# EAGLE schematic Charging Dock 1.8 (EAGLE 7.7.0)
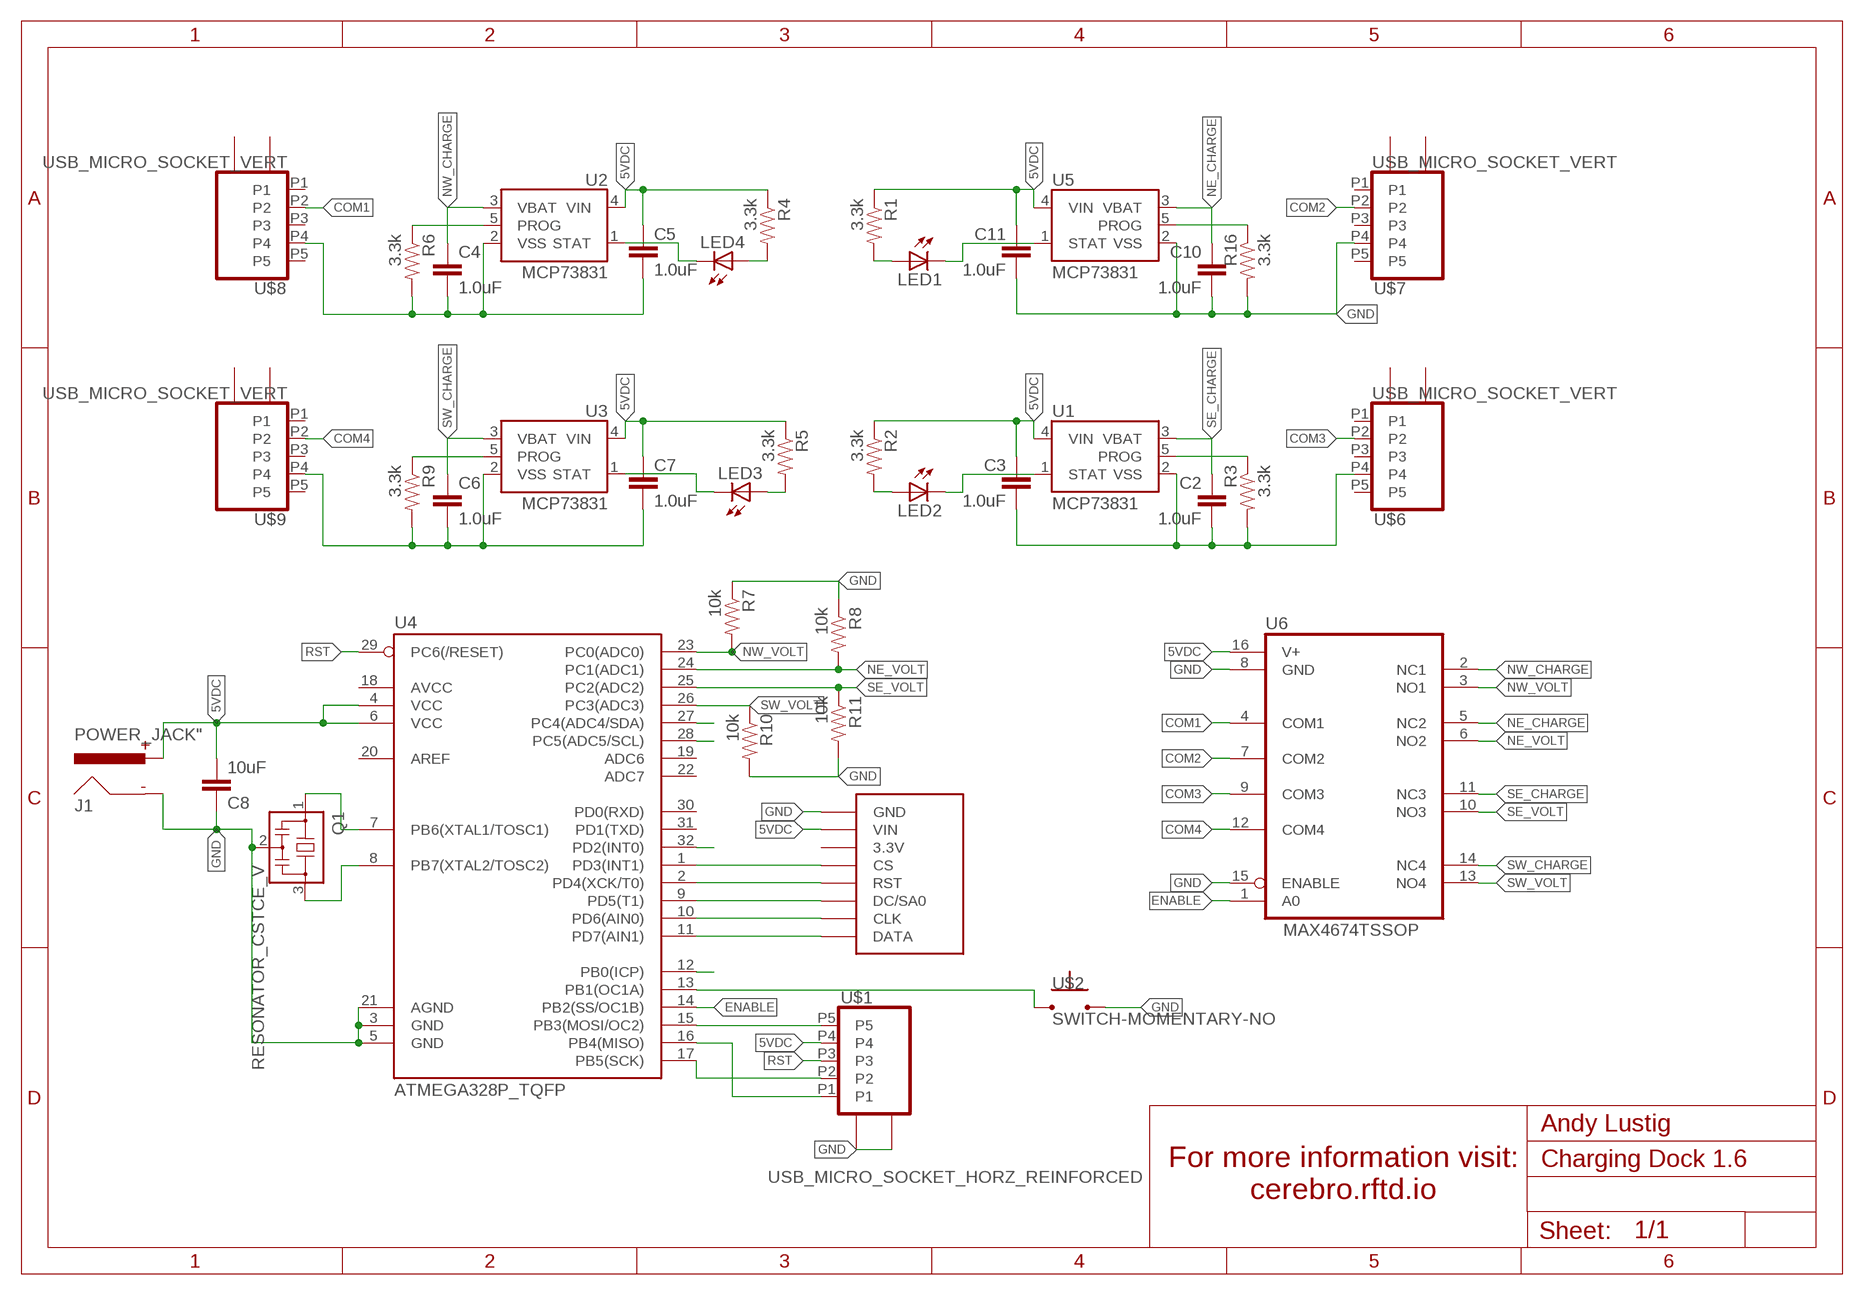
[diagram p0: schematic, sheet 1]

## Parts
C2  1.0uF  1.0UF-25V-+80/-20(0805)"  [0805-CAP]
C3  1.0uF  1.0UF-25V-+80/-20(0805)"  [0805-CAP]
C4  1.0uF  1.0UF-25V-+80/-20(0805)"  [0805-CAP]
C5  1.0uF  1.0UF-25V-+80/-20(0805)"  [0805-CAP]
C6  1.0uF  1.0UF-25V-+80/-20(0805)"  [0805-CAP]
C7  1.0uF  1.0UF-25V-+80/-20(0805)"  [0805-CAP]
C8  10uF  1.0UF-25V-+80/-20(0805)"  [0805-CAP]
C10  1.0uF  1.0UF-25V-+80/-20(0805)"  [0805-CAP]
C11  1.0uF  1.0UF-25V-+80/-20(0805)"  [0805-CAP]
J1  POWER_JACK"  [BARREL_CONN]
LED1  LEDCHIPLED_0805  [CHIPLED_0805]
LED2  LEDCHIPLED_0805  [CHIPLED_0805]
LED3  LEDCHIPLED_0805  [CHIPLED_0805]
LED4  LEDCHIPLED_0805  [CHIPLED_0805]
Q1  RESONATOR_CSTCE_V  [CSTCE_V]
R1  3.3k  RESISTOR0805-RES  [0805]
R2  3.3k  RESISTOR0805-RES  [0805]
R3  3.3k  RESISTOR0805-RES  [0805]
R4  3.3k  RESISTOR0805-RES  [0805]
R5  3.3k  RESISTOR0805-RES  [0805]
R6  3.3k  RESISTOR0805-RES  [0805]
R7  10k  RESISTOR0805-RES  [0805]
R8  10k  RESISTOR0805-RES  [0805]
R9  3.3k  RESISTOR0805-RES  [0805]
R10  10k  RESISTOR0805-RES  [0805]
R11  10k  RESISTOR0805-RES  [0805]
R16  3.3k  RESISTOR0805-RES  [0805]
U1  MCP73831  [SOT23-5]
U2  MCP73831  [SOT23-5]
U3  MCP73831  [SOT23-5]
U4  ATMEGA328P_TQFP  [TQFP32-08]
U5  MCP73831  [SOT23-5]
U6  MAX4674TSSOP  [TSSOP16]
U$1  USB_MICRO_SOCKET_HORZ_REINFORCED  [USB_HORZ_REINFORCED_MICRO]
U$2  SWITCH-MOMENTARY-NO  [SWITCH_MOMENTARY_XS]
U$6  USB_MICRO_SOCKET_VERT  [USB_VERT_MICRO_SMD]
U$7  USB_MICRO_SOCKET_VERT  [USB_VERT_MICRO_SMD]
U$8  USB_MICRO_SOCKET_VERT  [USB_VERT_MICRO_SMD]
U$9  USB_MICRO_SOCKET_VERT  [USB_VERT_MICRO_SMD]
U$10  OLED_DISPLAY  [OLED_DISPLAY]

## Nets
5VDC: C3.1 C5.1 C7.1 C8.2 C11.1 J1.PWR R1.1 R2.1 R4.1 R5.1 U1.4(VIN) U2.4(VIN) U3.4(VIN) U4.4(VCC) U4.6(VCC) U5.4(VIN) U6.16(V+) U$1.P4 U$10.VIN
COM1: U6.4(COM1) U$8.P2
COM2: U6.7(COM2) U$7.P2
COM3: U6.9(COM3) U$6.P2
COM4: U6.12(COM4) U$9.P2
ENABLE: U4.14(PB2(SS/OC1B)) U6.1(A0)
GND: C2.2 C3.2 C4.2 C5.2 C6.2 C7.2 C8.1 C10.2 C11.2 J1.GND Q1.2 R3.2 R6.2 R7.1 R8.1 R9.2 R10.2 R11.2 R16.2 U1.2(VSS) U2.2(VSS) U3.2(VSS) U4.3(GND) U4.5(GND) U4.21(AGND) U5.2(VSS) U6.8(GND) U6.15(ENABLE) U$1.G1 U$1.G2 U$1.P$1 U$1.P$2 U$2.P$2 U$6.P4 U$7.P4 U$8.P4 U$9.P4 U$10.GND
N$1: LED1.A R1.2
N$2: R9.1 U3.5(PROG)
N$3: LED3.A R5.2
N$4: LED2.C U1.1(STAT)
N$5: LED4.A R4.2
N$6: LED2.A R2.2
N$7: R6.1 U2.5(PROG)
N$9: LED4.C U2.1(STAT)
N$10: U4.15(PB3(MOSI/OC2)) U$1.P5
N$11: U4.17(PB5(SCK)) U$1.P2
N$12: U4.16(PB4(MISO)) U$1.P1
N$13: R16.1 U5.5(PROG)
N$14: U4.1(PD3(INT1)) U$10.CS
N$15: LED3.C U3.1(STAT)
N$16: Q1.3 U4.8(PB7(XTAL2/TOSC2))
N$17: Q1.1 U4.7(PB6(XTAL1/TOSC1))
N$18: U4.2(PD4(XCK/T0)) U$10.RST
N$19: U4.9(PD5(T1)) U$10.DC(DC/SA0)
N$20: U4.10(PD6(AIN0)) U$10.CLK
N$21: U4.27(PC4(ADC4/SDA))
N$22: U4.28(PC5(ADC5/SCL))
N$23: U4.11(PD7(AIN1)) U$10.DATA
N$24: R3.1 U1.5(PROG)
N$25: U4.13(PB1(OC1A)) U$2.P$1
N$26: U4.32(PD2(INT0))
N$27: U4.12(PB0(ICP))
N$42: LED1.C U5.1(STAT)
NE_CHARGE: C10.1 U5.3(VBAT) U6.5(NC2)
NE_VOLT: R8.2 U4.24(PC1(ADC1)) U6.6(NO2)
NW_CHARGE: C4.1 U2.3(VBAT) U6.2(NC1)
NW_VOLT: R7.2 U4.23(PC0(ADC0)) U6.3(NO1)
RST: U4.29(PC6(/RESET)) U$1.P3
SE_CHARGE: C2.1 U1.3(VBAT) U6.11(NC3)
SE_VOLT: R11.1 U4.25(PC2(ADC2)) U6.10(NO3)
SW_CHARGE: C6.1 U3.3(VBAT) U6.14(NC4)
SW_VOLT: R10.1 U4.26(PC3(ADC3)) U6.13(NO4)
Unconnected: U4.18(AVCC) U4.19(ADC6) U4.20(AREF) U4.22(ADC7) U4.30(PD0(RXD)) U4.31(PD1(TXD)) U$6.P1 U$6.P3 U$6.P5 U$6.P$1 U$6.P$2 U$6.P$3 U$7.P1 U$7.P3 U$7.P5 U$7.P$1 U$7.P$2 U$7.P$3 U$8.P1 U$8.P3 U$8.P5 U$8.P$1 U$8.P$2 U$8.P$3 U$9.P1 U$9.P3 U$9.P5 U$9.P$1 U$9.P$2 U$9.P$3

## Power pins joined to a net without a drawn wire
3.3V: U$10.3V3(3.3V)

## Library data of the parts
C2-C7 C10 C11 = SparkFun-Capacitors:1.0UF-25V-+80/-20(0805): CAP-11625; PROD_ID: CAP-11625
C8 = SparkFun-Capacitors:1.0UF-25V-+80/-20(0805): CAP-11625; PROD_ID: CAP-11625; VALUE: 1.0uF
J1 = Andy-library:POWER_JACK: 5mm Barrel Power Connector CP-037A-ND <http://www.digikey.com/product-detail/en/cui-inc/PJ-037A/CP-037A-ND/1644545>; DIGIKEY_PN: CP-037A-ND; MANUFACTURER: CUI Inc; MFG_PN: PJ-037A
LED1-LED4 = adafruit:LED: LED OSRAM: - CHIPLED LG R971, LG N971, LY N971, LG Q971, LY Q971, LO R971, LY R971 LH N974, LH R974 LS Q976, LO Q976, LY Q976 LO Q996 - Hyper CHIPLED LW Q18S LB Q993, LB Q99A, LB R99A - SideLED LS A670, LO A670, LY A670, LG A670, LP A670 LB A673, LV A673, LT A673, LW A673 LH A674 LY A675 LS A676, LA A676, LO A676, LY A676, LW A676 LS A679, LY A679, LG A679 - Hyper Micro SIDELED® LS Y876, LA Y876, LO Y876, LY Y876 LT Y87S - SmartLED LW L88C, LW L88S LB L89C, LB L89S, LG L890 LS L89K, LO L89K, LY L89K LS L896, LA L896, LO L896, LY L896 - TOPLED LS T670, LO T670, LY T670, LG T670, LP T670 LSG T670, LSP T670, LSY T670, LOP T670, LYG T670 LG T671, LOG T671, LSG T671 LB T673, LV T673, LT T673, LW T673 LH T674 LS T676, LA T676, LO T676, LY T676, LB T676, LH T676, LSB T676, LW T676 LB T67C, LV T67C, LT T67C, LS T67K, LO T67K, LY T67K, LW E67C LS E67B, LA E67B, LO E67B, LY E67B, LB E67C, LV E67C, LT E67C LW T67C LS T679, LY T679, LG T679 LS T770, LO T770, LY T770, LG T770, LP T770 LB T773, LV T773, LT T773, LW T773 LH T774 LS E675, LA E675, LY E675, LS T675 LS T776, LA T776, LO T776, LY T776, LB T776 LHGB T686 LT T68C, LB T68C - Hyper Mini TOPLED® LB M676 - Mini TOPLED Santana® LG M470 LS M47K, LO M47K, LY M47K Source: http://www.osram.convergy.de/
Q1 = Andy-library:RESONATOR: 16 MHz Resonator(Murata p/n CSTCE16M0V53-R0) Digikey: 490-1198-1-ND <http://www.digikey.com/product-search/en?keywords=490-1198-1-nd>
R1-R11 R16 = Andy-library:RESISTOR: Resistor Basic schematic elements and footprints for 0603, 1206, and PTH resistors.
U1-U3 U5 = SparkFun-PowerIC:MCP73831: Miniature single cell, fully integrated Li-Ion, Li-polymer charge management controller http://ww1.microchip.com/downloads/en/DeviceDoc/20001984g.pdf IC-09995; PROD_ID: IC-09995
U4 = SparkFun-DigitalIC:ATMEGA328P_TQFP; PROD_ID: IC-09069
U6 = Andy-library:MAX4674: Maxim Integrated MAX4674EUE+T 4 Circuit SPDT switch IC. MAX4674EUE+TDKR-ND <http://www.digikey.com/scripts/DkSearch/dksus.dll?Detail&itemSeq=214628837&uq=636177658145421791> TSSOP 16
U$1 U$6-U$9 = Andy-library:USB_MICRO_SOCKET: horizontal socket. Digikey 609-4616-1-ND
U$2 = Andy-library:SWITCH-MOMENTARY-NO
U$10 = Andy-library:OLED_DISPLAY

## Net classes
0 default: width 0.254 mm, clearance 0.254 mm
1 power: width 0.61 mm, drill 0.61 mm, clearance 0.254 mm
2 gnd: width 0.305 mm, drill 0.559 mm, clearance 0.254 mm
3 usbvcc: width 0.508 mm, drill 0.61 mm, clearance 0.254 mm
4 aref: width 0.406 mm, drill 0.61 mm, clearance 0.254 mm